# EasyEDA schematic ATtiny25_2020-08-31_22-25-55.json
TITLE: Sheet_1; REV: 1.0; Date: 2020-08-31; Sheet: 1/1; Drawn By: uvpdrvegknzojefymp; Company: Your Company
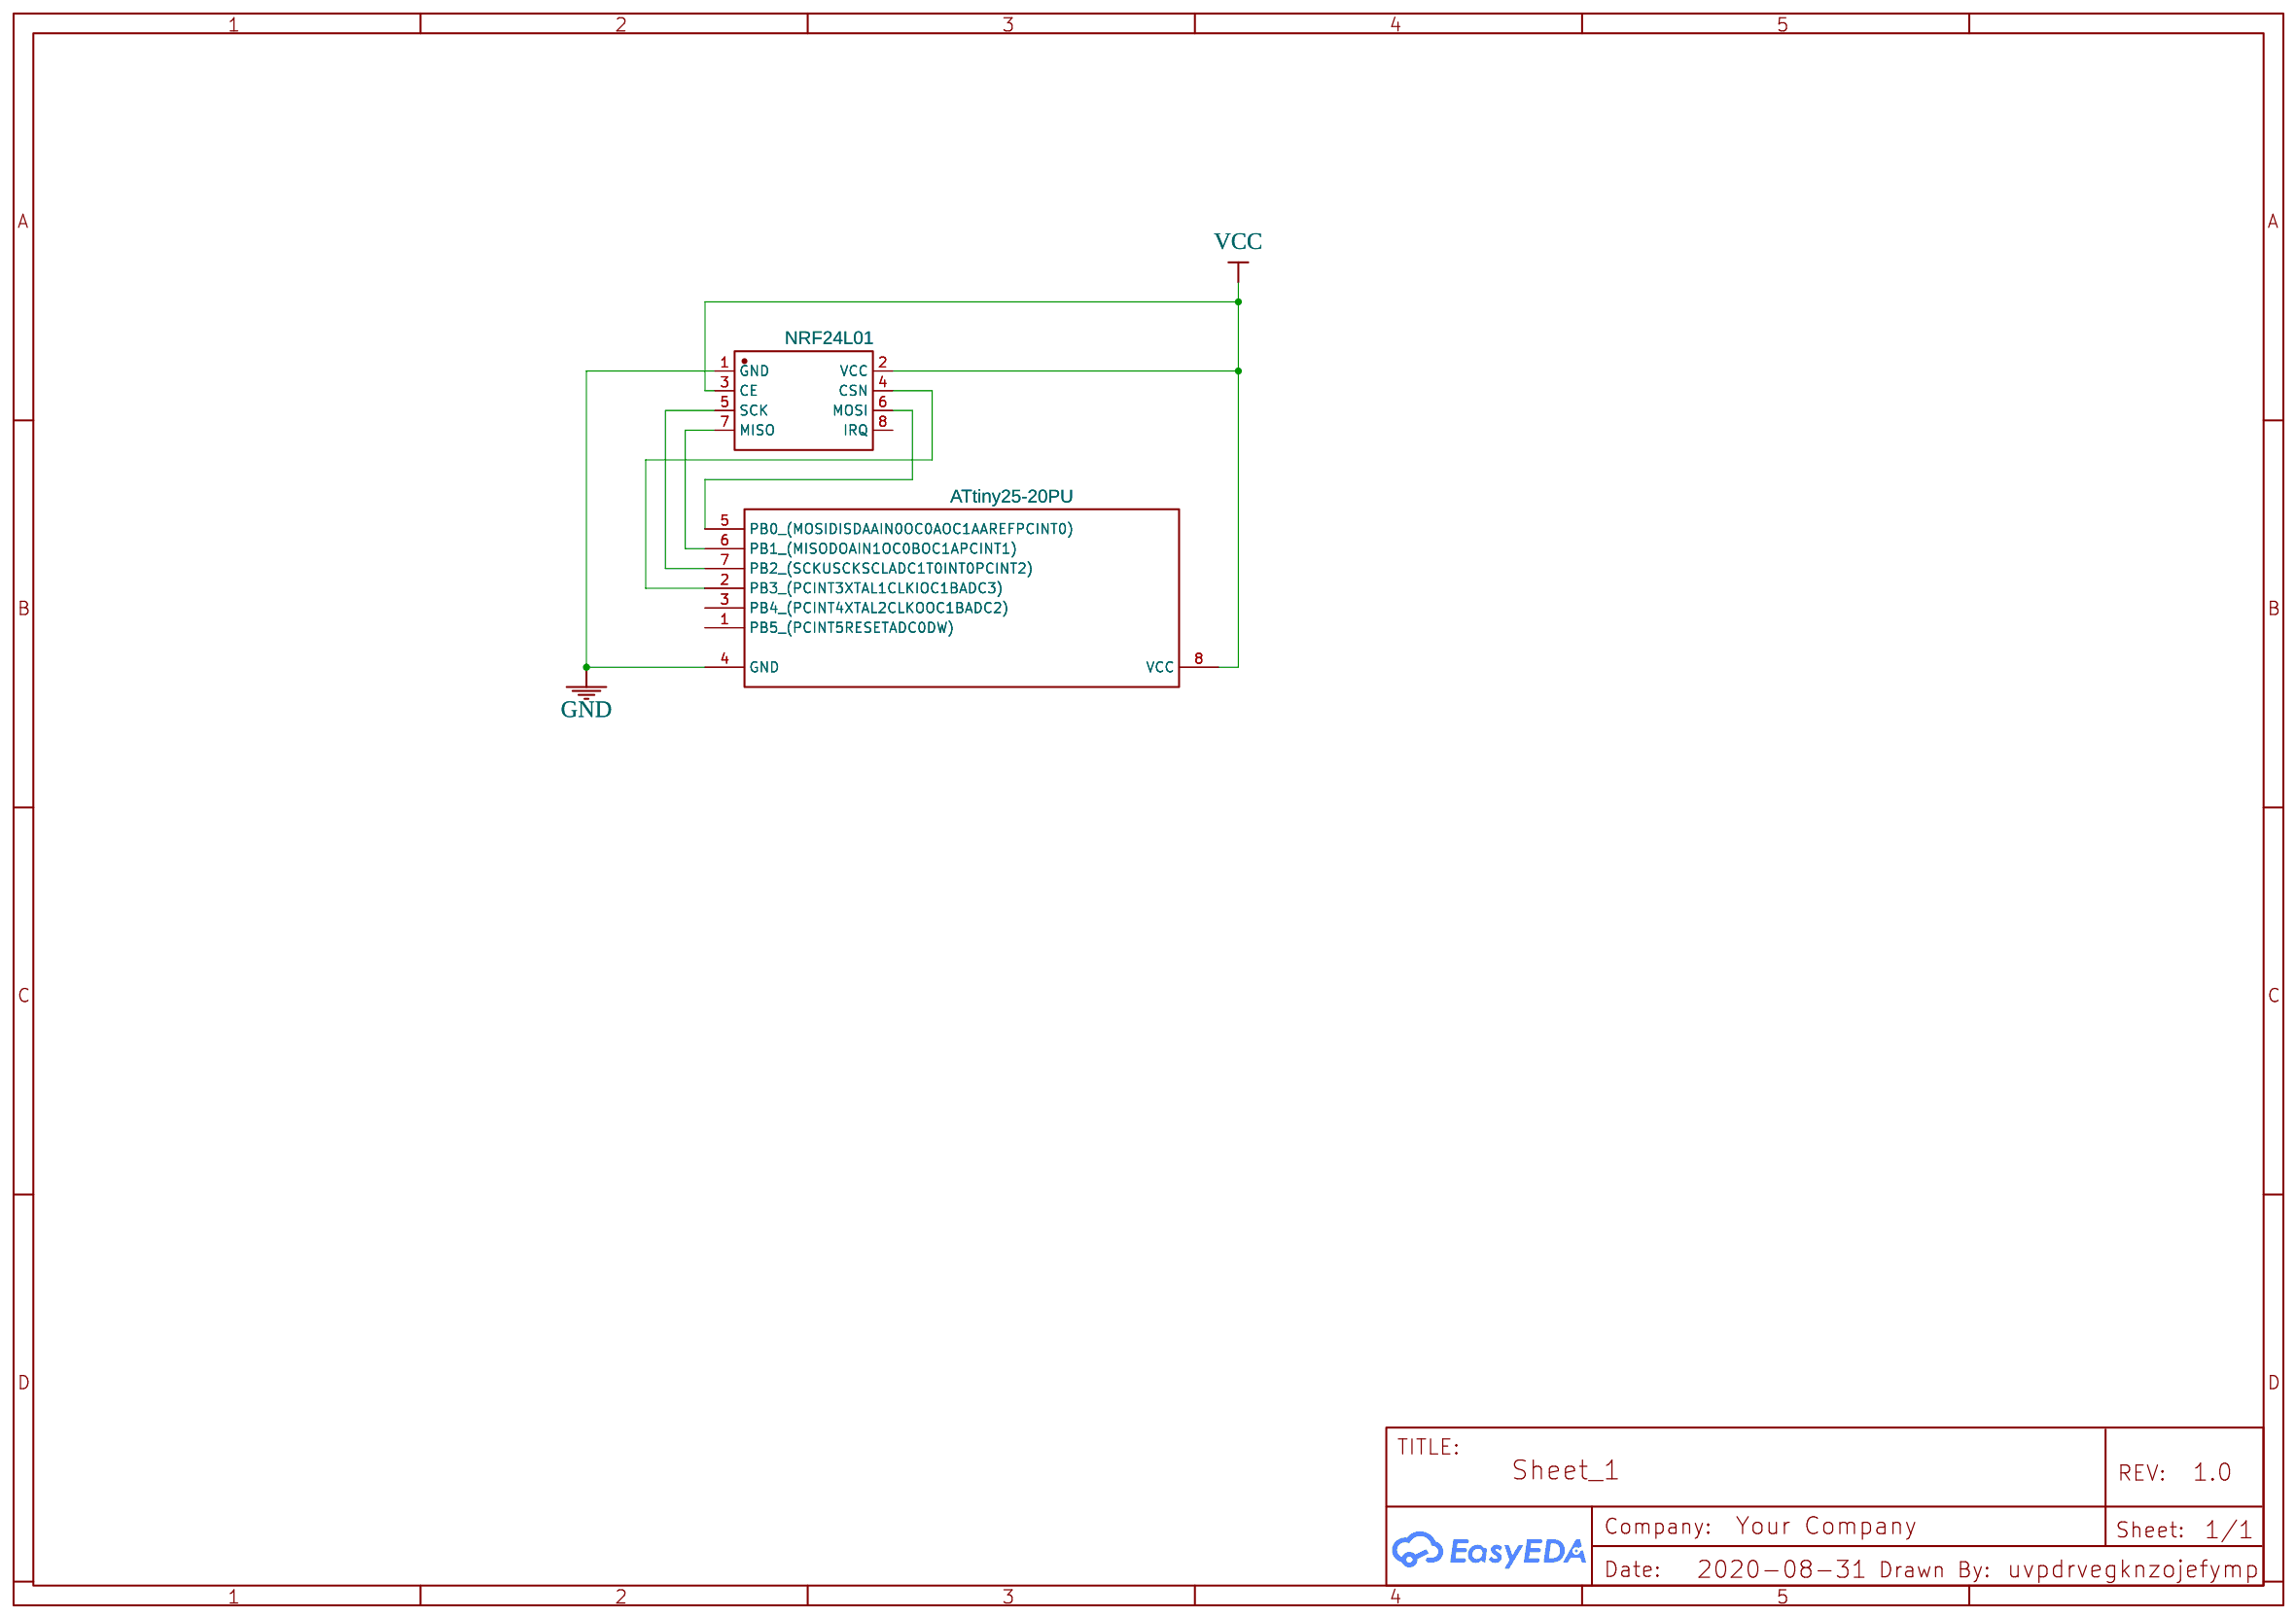
[diagram p0: schematic sheet]

## Parts
MK1  NRF24L01  [WIRELM-SMD_NRF24L01]
U1  ATtiny25-20PU  [DIP8]

## Library data of the parts
MK1 = NRF24L01: Supplier: LCSC; Manufacturer: Ai-Thinker; Manufacturer Part: NRF24L01+功率加强版绑定2.4Gwireless module; Supplier Part: C90751
U1 = ATtiny25-20PU: 8-bit AVR Microcontroller, 20MHz, 2.7-5.5V, 2KB Flash, 128 Bytes EEPROM, 128 Bytes SRAM, 8-pin PDIP, Industrial Grade (-40u7648 to 85u7648), Pb-Free

## Nets
GND: MK1.1(GND) U1.4(GND)
VCC: MK1.2(VCC) MK1.3(CE) U1.8(VCC)
Net-(MK1-4): MK1.4(CSN) U1.2(PB3 (PCINT3XTAL1CLKIOC1BADC3))
Net-(MK1-5): MK1.5(SCK) U1.7(PB2 (SCKUSCKSCLADC1T0INT0PCINT2))
Net-(MK1-6): MK1.6(MOSI) U1.5(PB0 (MOSIDISDAAIN0OC0AOC1AAREFPCINT0))
Net-(MK1-7): MK1.7(MISO) U1.6(PB1 (MISODOAIN1OC0BOC1APCINT1))

Not connected (* = marked no-connect by the designer): MK1 8(IRQ); U1 1(PB5 (PCINT5RESETADC0DW)) 3(PB4 (PCINT4XTAL2CLKOOC1BADC2))
